# EAGLE schematic tritiled22_lux_z (EAGLE 8.2.2)
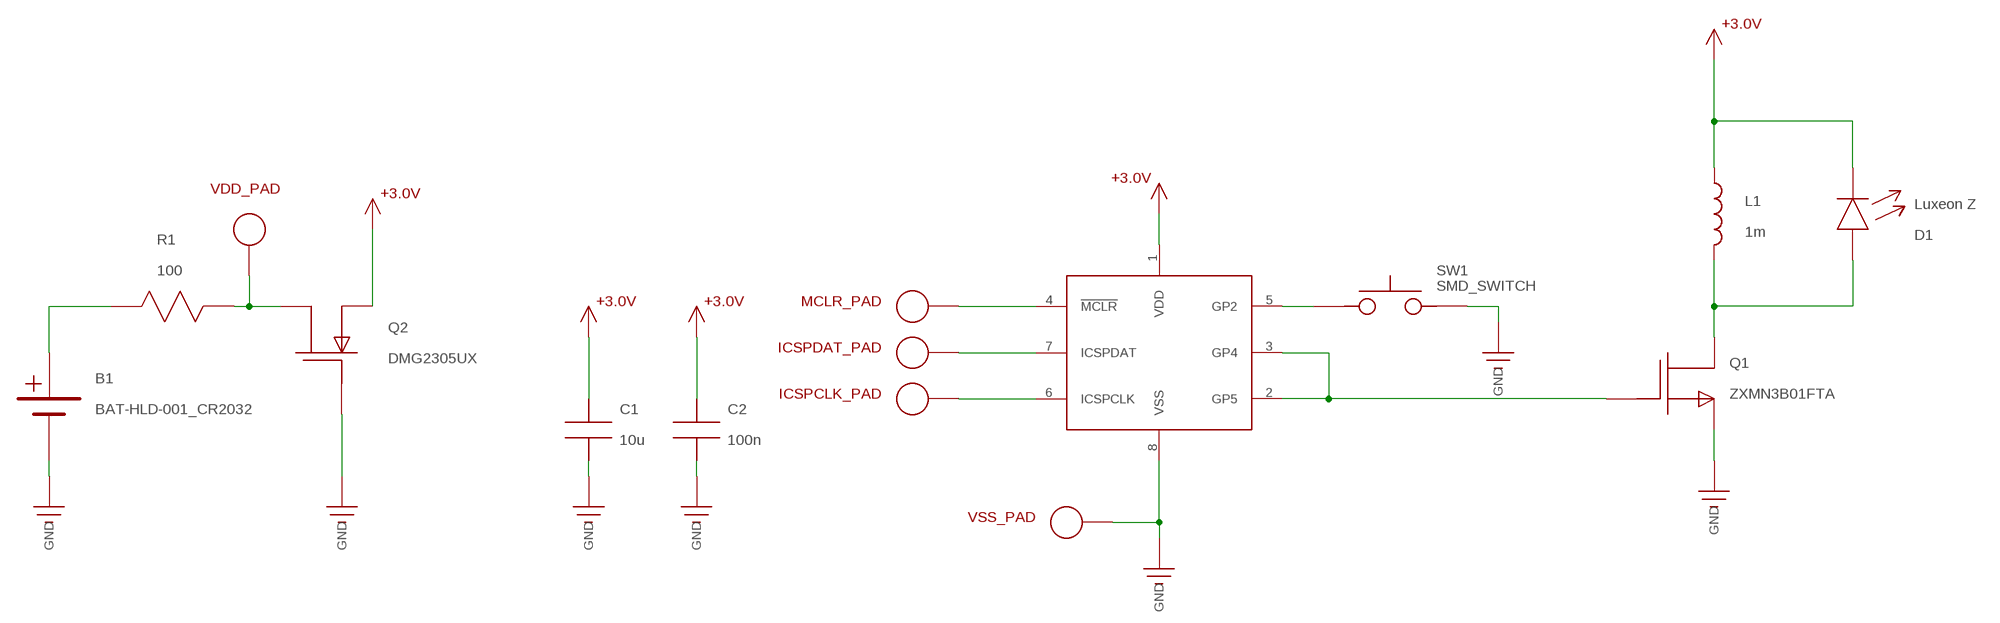
[diagram p0: schematic, sheet 1]

## Parts
B1  BAT-HLD-001_CR2032  [CR2032_BAT-HLD_001]
C1  10u  C1206  [1206]
C2  100n  C0805  [0805]
D1  Luxeon Z  LEDLUXEON_Z  [LUXEON_Z]
ICSPCLK_PAD  ICSP_PAD  [ICSP_PAD]
ICSPDAT_PAD  ICSP_PAD  [ICSP_PAD]
L1  1m  SRR6028_INDUCTOR  [SRR6028_INDUCTOR]
MCLR_PAD  ICSP_PAD  [ICSP_PAD]
Q1  ZXMN3B01FTA  ZXMN3B01FSOT23  [SOT-23]
Q2  DMG2305UX  DMG2305UXSOT23  [SOT-23]
R1  100  R1206  [R1206]
SW1  SMD_SWITCH  [SMD_SWITCH]
U1  PIC12LF1571  [SOIC8]
VDD_PAD  ICSP_PAD  [ICSP_PAD]
VSS_PAD  ICSP_PAD  [ICSP_PAD]

## Nets
+3.3V: C1.P$1 C2.P$1 D1.C L1.P$1 Q2.2(S) U1.1(VDD) ; supply symbol labelled +3.0V
GND: B1.GND(0V) C1.P$2 C2.P$2 Q1.2(S) Q2.1(G) SW1.P$3 SW1.P$4 U1.8(VSS) VSS_PAD.P$2
N$1: MCLR_PAD.P$2 U1.4(!MCLR!)
N$2: ICSPDAT_PAD.P$2 U1.7(ICSPDAT)
N$4: ICSPCLK_PAD.P$2 U1.6(ICSPCLK)
N$5: D1.A L1.P$2 Q1.3(D)
N$6: SW1.P$1 SW1.P$2 U1.5(GP2)
N$8: Q1.1(G) U1.2(GP5) U1.3(GP4)
VBATT: B1.+V1(+V) B1.+V2(+V) R1.P$1
VSAFE: Q2.3(D) R1.P$2 VDD_PAD.P$2

## Library data of the parts
B1 = tritiled:BAT-HLD-001_CR2032
C1 C2 = tritiled:C
D1 = tritiled:LED
ICSPCLK_PAD ICSPDAT_PAD MCLR_PAD VDD_PAD VSS_PAD = led_temp:ICSP_PAD
L1 = tritiled:SRR6028_INDUCTOR
Q1 = tritiled:ZXMN3B01F
Q2 = tritiled:DMG2305UX
R1 = tritiled:R
SW1 = tritiled:SMD_SWITCH
U1 = tritiled:PIC12LF1571